# EAGLE design fngen (EAGLE 5.10)
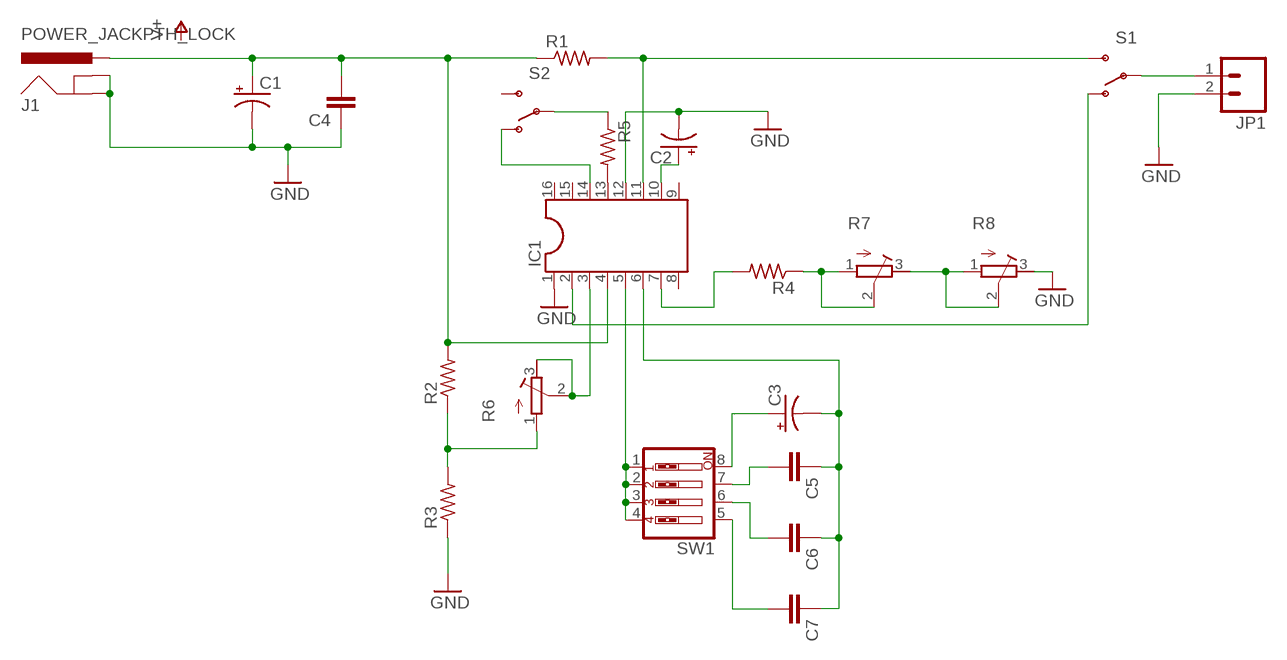
[diagram p0: schematic, sheet 1]

## Parts
C1  CPOL-USE5-10.5  [E5-10,5]
C2  CPOL-USE5-10.5  [E5-10,5]
C3  CPOL-USE5-10.5  [E5-10,5]
C4  C2.5/2  [C2.5-2]
C5  C2.5/2  [C2.5-2]
C6  C2.5/2  [C2.5-2]
C7  C2.5/2  [C2.5-2]
IC1  DIL16S  [SOCKET-16]
J1  POWER_JACKPTH_LOCK  [POWER_JACK_PTH_LOCK]
JP1  M023.5MM_LOCK  [SCREWTERMINAL-3.5MM-2_LOCK]
R1  R-US_0207/10  [0207/10]
R2  R-US_0207/10  [0207/10]
R3  R-US_0207/10  [0207/10]
R4  R-US_0207/10  [0207/10]
R5  R-US_0207/10  [0207/10]
R6  R-TRIMM64W  [RTRIM64W]
R7  R-TRIMM64W  [RTRIM64W]
R8  R-TRIMM64W  [RTRIM64W]
S1  SWITCH-SPSTKIT  [SWITCH-SPDT_KIT]
S2  SWITCH-SPSTKIT  [SWITCH-SPDT_KIT]
SW1  SW_DIP-4  [EDG-04]

## Nets
GND: C1.- C2.- C4.1 IC1.1 IC1.12 J1.GND J1.GNDBREAK JP1.2 R3.1 R8.3(A)
N$1: IC1.13 R5.2
N$2: IC1.7 R4.2
N$3: R4.1 R7.1(E) R7.2(S)
N$4: R7.3(A) R8.1(E) R8.2(S)
N$5: C3.- C5.1 C6.1 C7.1 IC1.6
N$6: C5.2 SW1.7
N$7: C6.2 SW1.6
N$8: C7.2 SW1.5
N$9: C3.+ SW1.8
N$10: IC1.5 SW1.1 SW1.2 SW1.3 SW1.4
N$11: IC1.3 R6.2(S) R6.3(A)
N$12: R2.1 R3.2 R6.1(E)
N$13: C1.+ C4.2 IC1.4 J1.PWR R1.1 R2.2
N$14: IC1.2 S1.1(O)
N$15: IC1.14 S2.1(O)
N$16: C2.+ IC1.10
N$17: R5.1 S2.2(P)
N$19: IC1.11 R1.2 S1.3(S)
N$23: JP1.1 S1.2(P)
Unconnected: IC1.8 IC1.9 IC1.15 IC1.16 S2.3(S)

## Library data of the parts
C1-C3 = adafruit:CPOL-US: POLARIZED CAPACITOR, American symbol
C4-C7 = capacitor-wima:C: CAPACITOR naming: grid - package width
IC1 = ic-package:DIL16: Dual In Line / Socket
J1 = SparkFun:POWER_JACK: Power Jack This is the standard 5.5mm barrel jack for power. The PTH is the most common, proven, reliable, footprint. All others are experimental. The Slot footprint only works if the mill layer is transmitted to the PCB fab house so be warned. Spark Fun Electronics SKU : PRT-00119. Mating wall wart : TOL-00298 (and others)
JP1 = SparkFun:M02: Header 2 Standard 2-pin 0.1" header. Use with straight break away headers (SKU : PRT-00116), right angle break away headers (PRT-00553), swiss pins (PRT-00743), machine pins (PRT-00117), and female headers (PRT-00115). Molex polarized connector foot print use with SKU : PRT-08233 with associated crimp pins and housings.
R1-R5 = adafruit:R-US_: RESISTOR, American symbol
R6-R8 = resistor:R-TRIMM: Trimm resistor
S1 S2 = SparkFun:SWITCH-SPST: SPST Switch Simple slide switch. Spark Fun Electronics SKU : COM-00102
SW1 = special:SW_DIP-4: DIP SWITCH

## Board
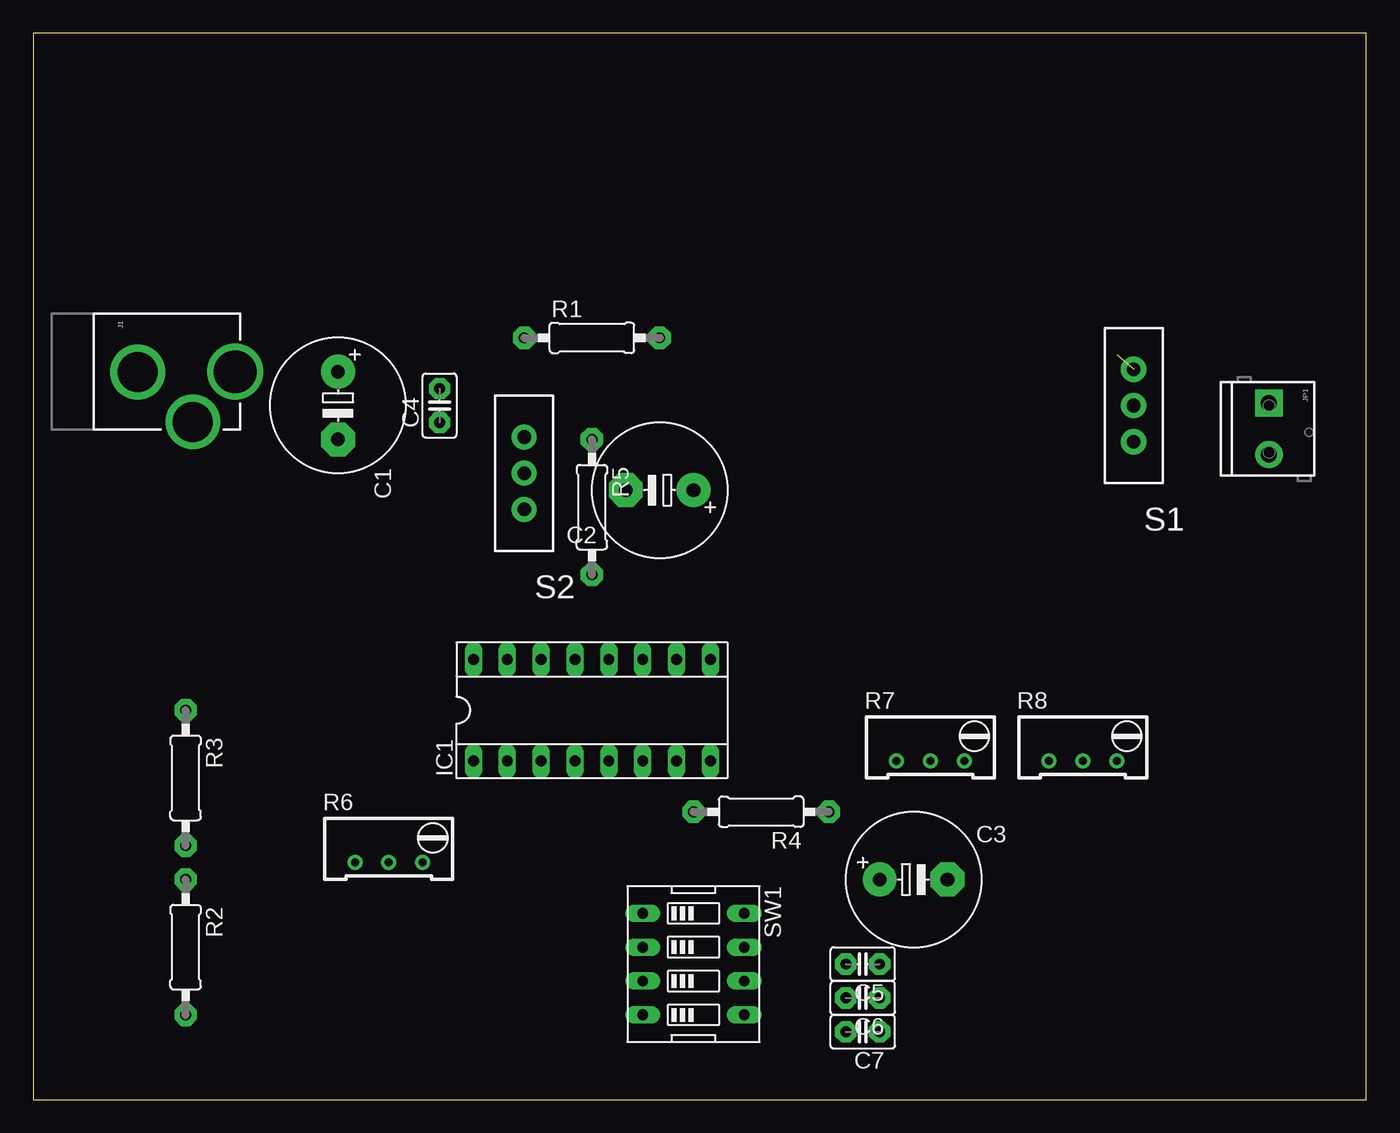
[diagram p1: board, top side]
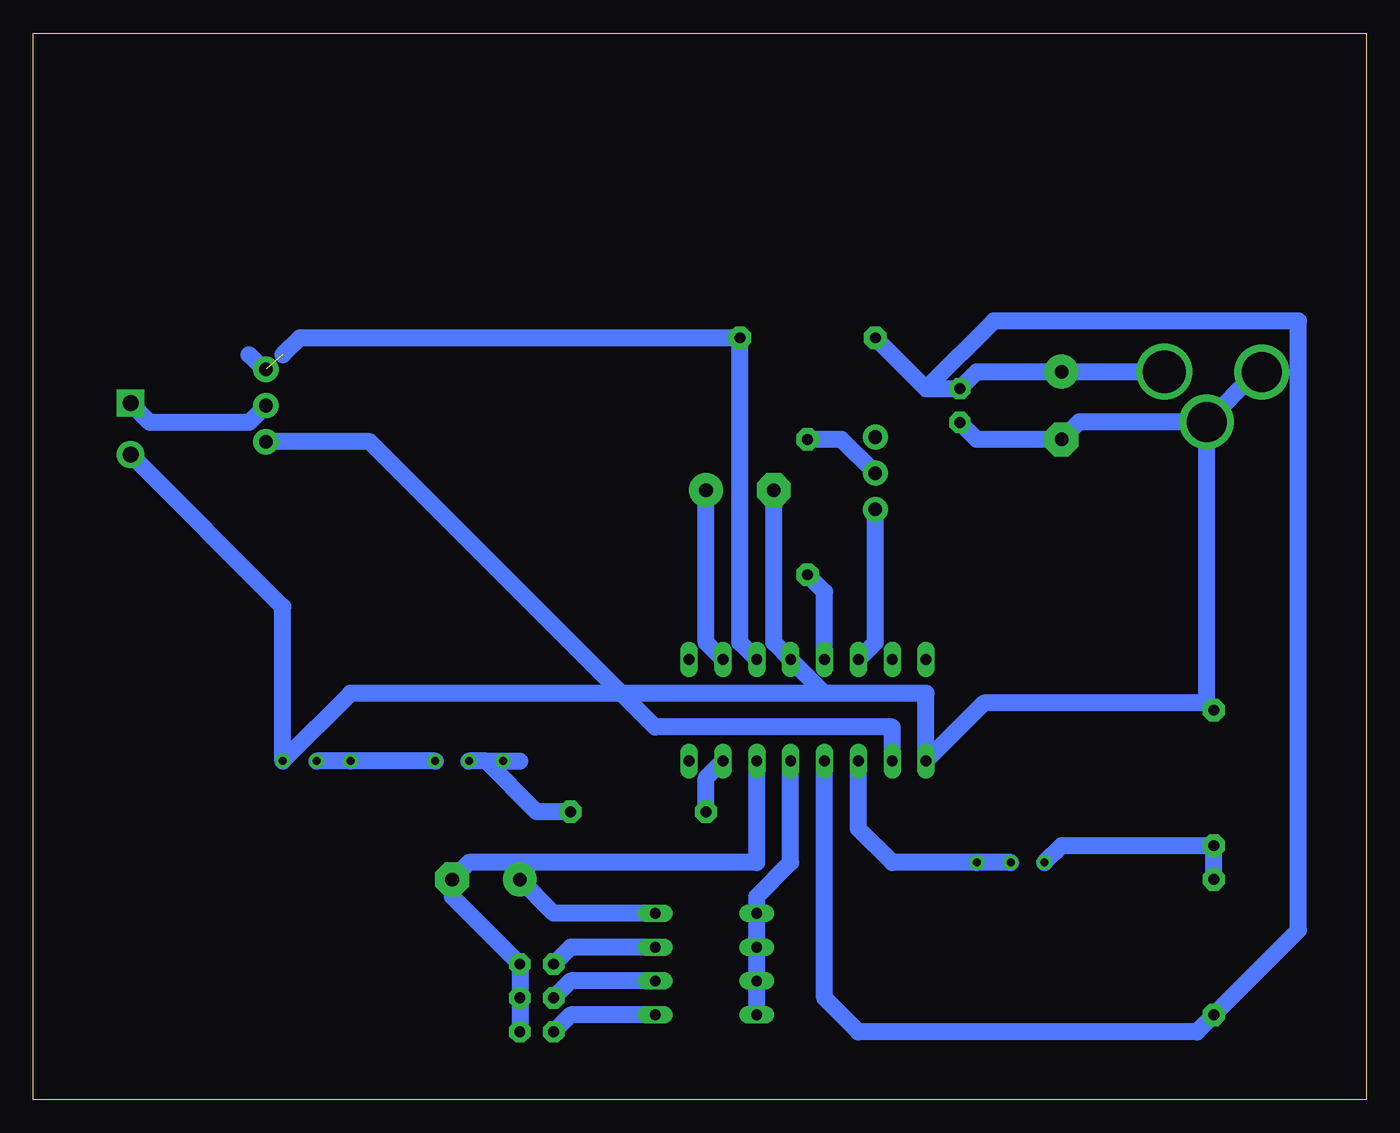
[diagram p2: board, bottom side, seen from below]

Size 100 x 80 mm. Coordinates in mm from the lower left corner, seen from the top.
Outline: 0,0 100,0 100,80 0,80 0,0
Copper layers (1*16): Top 0.035mm / dielectric 1.5mm / Bottom 0.035mm
Design rules "default": minimum track width 10mil, minimum drill 24mil, track to track 8mil, track to pad 8mil, pad to pad 8mil, via to via 8mil, smd to smd 8mil, copper to edge 40mil, drill to drill 8mil, minimum pad ring 10mil, minimum via ring 8mil, stop-mask expansion 4mil, vias tented up to drill 0mil, thermal gap 10mil

### Footprints (pad centres in the part's own frame; a part is rotated, then mirrored left to right if it is on the bottom)
E5-10,5 = drill 1.016 pad 2.54 round: + -2.54,0 | drill 1.016 pad 2.54 octagon: - 2.54,0
C2.5-2 = drill 0.813 pad 1.6 octagon: 1 -1.27,0; 2 1.27,0
SOCKET-16 = drill 0.813 long: 1 -8.89,-3.81; 2 -6.35,-3.81; 3 -3.81,-3.81; 4 -1.27,-3.81; 5 1.27,-3.81; 6 3.81,-3.81; 7 6.35,-3.81; 8 8.89,-3.81; 9 8.89,3.81; 10 6.35,3.81; 11 3.81,3.81; 12 1.27,3.81; 13 -1.27,3.81; 14 -3.81,3.81; 15 -6.35,3.81; 16 -8.89,3.81
POWER_JACK_PTH_LOCK = drill 2.997 pad 4.115 round: GND 0.025,6.557; GNDBREAK 3.762,10.7 | drill 3.2 pad 4.115 round: PWR 0,13.878
SCREWTERMINAL-3.5MM-2_LOCK = drill 1.2 pad 2.032 square: 1 -0.178,0 | drill 1.2 pad 2.032 round: 2 3.678,0
0207/10 = drill 0.813 pad 1.676 octagon: 1 -5.08,0; 2 5.08,0
RTRIM64W = drill 0.61 round: 1 1.27,-2.54; 2 1.27,0; 3 1.27,2.54
SWITCH-SPDT_KIT = drill 1.016 pad 1.88 round: 1 0,2.718; 2 0,0; 3 0,-2.718
EDG-04 = drill 0.813 long: 1 -3.81,-3.81; 2 -1.27,-3.81; 3 1.27,-3.81; 4 3.81,-3.81; 5 3.81,3.81; 6 1.27,3.81; 7 -1.27,3.81; 8 -3.81,3.81

### Placement (x,y rotation side)
C1  22.86,52.07 270 top
C2  46.99,45.72 180 top
C3  66.04,16.51 0 top
C4  30.48,52.07 90 top
C5  62.23,10.16 180 top
C6  62.23,7.62 180 top
C7  62.23,5.08 180 top
IC1  41.91,29.21 0 top
J1  1.27,54.61 270 top
JP1  92.71,52.07 270 top
R1  41.91,57.15 0 top
R2  11.43,11.43 270 top
R3  11.43,24.13 270 top
R4  54.61,21.59 180 top
R5  41.91,44.45 270 top
R6  26.67,19.05 270 top
R7  67.31,26.67 270 top
R8  78.74,26.67 270 top
S1  82.55,52.07 180 top
S2  36.83,46.99 180 top
SW1  49.53,10.16 270 top

### Tracks (layer width: path | path; a pad name or v marks a point on that pad's centre or on a via)
GND
  Bottom 1.27: 11.97,29.75 J1.GNDBREAK | R3.1 11.97,29.75 | J1.GND 8.23,54.59 J1.GNDBREAK | J1.GNDBREAK 21.54,50.85 C1.- 29.21,49.53 C4.1 | 11.97,29.75 28.67,29.75 IC1.1 33.02,30.48 40.64,30.48 | 40.64,30.48 IC1.12 44.45,34.29 C2.- | 40.64,30.48 76.2,30.48 R8.3 81.28,36.96 JP1.2
N$1
  Bottom 1.27: IC1.13 40.64,38.1 R5.2
N$2
  Bottom 1.27: R4.2 49.53,24.13 IC1.7
N$3
  Bottom 1.27: 66.04,25.4 R7.1 63.5,25.4 | 66.04,25.4 R7.2 | R4.1 62.23,21.59 66.04,25.4
N$4
  Bottom 1.27: R8.2 R8.1 R7.3
N$5
  Bottom 1.27: IC1.6 45.72,17.78 67.31,17.78 C3.- 68.58,15.24 C5.1 C6.1 C7.1
N$6
  Bottom 1.27: SW1.7 59.69,11.43 C5.2
N$7
  Bottom 1.27: SW1.6 59.69,8.89 C6.2
N$8
  Bottom 1.27: SW1.5 59.69,6.35 C7.2
N$9
  Bottom 1.27: SW1.8 60.96,13.97 C3.+
N$10
  Bottom 1.27: IC1.5 43.18,17.78 45.72,15.24 SW1.1 SW1.2 SW1.3 SW1.4
N$11
  Bottom 1.27: R6.2 R6.3 35.56,17.78 38.1,20.32 IC1.3
N$12
  Bottom 1.27: R2.1 R3.2 22.86,19.05 R6.1
N$13
  Bottom 1.27: IC1.4 40.64,7.62 38.1,5.08 12.7,5.08 R2.2 5.08,12.7 5.08,58.42 27.94,58.42 33.02,53.34 | J1.PWR C1.+ 29.21,54.61 C4.2 33.02,53.34 | 33.02,53.34 R1.1
N$14
  Bottom 1.27: S1.1 74.75,49.35 53.34,27.94 35.56,27.94 IC1.2
N$15
  Bottom 1.27: S2.1 36.83,34.29 IC1.14
N$16
  Bottom 1.27: C2.+ 49.53,34.29 IC1.10
N$17
  Bottom 1.27: R5.1 39.37,49.53 S2.2
N$19  (1 unrouted)
  Bottom 1.27: 81.28,55.88 80.01,57.15 R1.2 46.99,34.29 IC1.11 | S1.3 82.73,54.79 83.82,55.88
N$23
  Bottom 1.27: S1.2 83.82,50.8 91.26,50.8 JP1.1